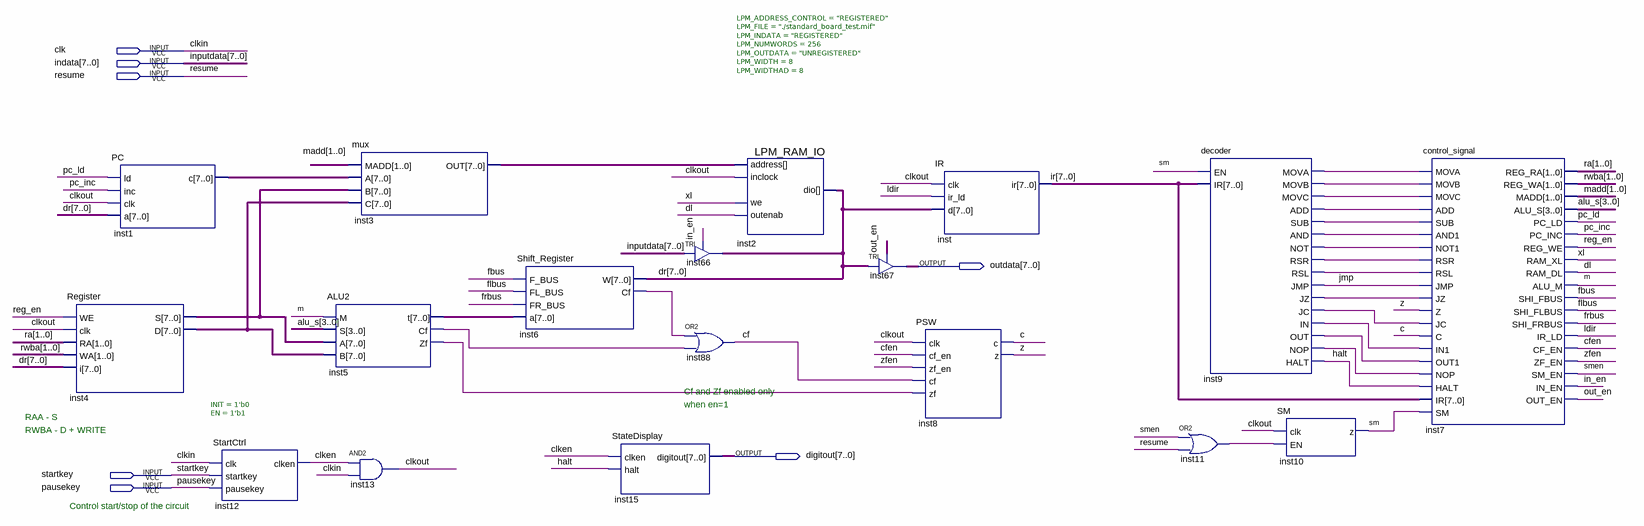
[diagram p0: schematic sheet]
// Quartus schematic model_computer.bdf as structural Verilog: 18 symbols, 7 pins
module model_computer (
  input  clk,
  input  [7:0] indata,
  input  resume,
  input  startkey,
  input  pausekey,
  output [7:0] outdata,
  output [7:0] digitout
);

  wire c, cf, cfen, clken, clkout, dl, fbus, flbus, frbus, halt, in_en, inst5_cf, inst5_zf, inst6_cf,
       inst9_add, inst9_and, inst9_in, inst9_jc, inst9_jz, inst9_mova, inst9_movb, inst9_movc, inst9_nop,
       inst9_not, inst9_out, inst9_rsl, inst9_rsr, inst9_sub, inst11_out, jmp, ldir, m, out_en, pc_inc,
       pc_ld, reg_en, sm, smen, xl, z, zfen;
  wire [1:0] madd, ra, rwba;
  wire [3:0] alu_s;
  wire [7:0] dr, inst1_c, inst3_out, inst4_d, inst4_s, inst5_t, ir;

  Register inst4 (.WE(reg_en), .clk(clkout), .RA(ra), .WA(rwba), .i(dr), .S(inst4_s), .D(inst4_d));
  PC inst1 (.ld(pc_ld), .inc(pc_inc), .clk(clkout), .a(dr), .c(inst1_c));
  StartCtrl #(.INIT(1'b0), .EN(1'b1)) inst12 (.clk(clk), .startkey(startkey), .pausekey(pausekey), .clken(clken));
  mux inst3 (.MADD(madd), .A(inst1_c), .B(inst4_s), .C(inst4_d), .OUT(inst3_out));
  ALU2 inst5 (.M(m), .S(alu_s), .A(inst4_s), .B(inst4_d), .t(inst5_t), .Cf(inst5_cf), .Zf(inst5_zf));
  and inst13 (clkout, clken, clk);
  Shift_Register inst6 (.F_BUS(fbus), .FL_BUS(flbus), .FR_BUS(frbus), .a(inst5_t), .W(dr), .Cf(inst6_cf));
  StateDisplay inst15 (.clken(clken), .halt(halt), .digitout(digitout));
  TRI inst66[7:0] (.IN(indata), .OE(in_en), .OUT(dr));
  or inst88 (cf, inst6_cf, inst5_cf);
  LPM_RAM_IO #(.LPM_ADDRESS_CONTROL("REGISTERED"), .LPM_FILE("./standard_board_test.mif"), .LPM_INDATA("REGISTERED"), .LPM_NUMWORDS(256), .LPM_OUTDATA("UNREGISTERED"), .LPM_WIDTH(8), .LPM_WIDTHAD(8)) inst2 (
    .address(inst3_out), .inclock(clkout), .outenab(dl), .we(xl), .dio(dr));
  TRI inst67[7:0] (.IN(dr), .OE(out_en), .OUT(outdata));
  PSW inst8 (.clk(clkout), .cf_en(cfen), .zf_en(zfen), .cf(cf), .zf(inst5_zf), .c(c), .z(z));
  IR inst (.clk(clkout), .ir_ld(ldir), .d(dr), .ir(ir));
  or inst11 (inst11_out, smen, resume);
  decoder inst9 (
    .EN(sm), .IR(ir), .MOVA(inst9_mova), .MOVB(inst9_movb), .MOVC(inst9_movc), .ADD(inst9_add),
    .SUB(inst9_sub), .AND(inst9_and), .NOT(inst9_not), .RSR(inst9_rsr), .RSL(inst9_rsl), .JMP(jmp),
    .JZ(inst9_jz), .JC(inst9_jc), .IN(inst9_in), .OUT(inst9_out), .NOP(inst9_nop), .HALT(halt));
  SM inst10 (.clk(clkout), .EN(inst11_out), .z(sm));
  control_signal inst7 (
    .MOVA(inst9_mova), .MOVB(inst9_movb), .MOVC(inst9_movc), .ADD(inst9_add), .SUB(inst9_sub),
    .AND1(inst9_and), .NOT1(inst9_not), .RSR(inst9_rsr), .RSL(inst9_rsl), .JMP(jmp), .JZ(inst9_jz), .Z(z),
    .JC(inst9_jc), .C(c), .IN1(inst9_in), .OUT1(inst9_out), .NOP(inst9_nop), .HALT(halt), .IR(ir), .SM(sm),
    .REG_RA(ra), .REG_WA(rwba), .MADD(madd), .ALU_S(alu_s), .PC_LD(pc_ld), .PC_INC(pc_inc), .REG_WE(reg_en),
    .RAM_XL(xl), .RAM_DL(dl), .ALU_M(m), .SHI_FBUS(fbus), .SHI_FLBUS(flbus), .SHI_FRBUS(frbus), .IR_LD(ldir),
    .CF_EN(cfen), .ZF_EN(zfen), .SM_EN(smen), .IN_EN(in_en), .OUT_EN(out_en));

  // Other names for the same wires on the sheet: clkin = clk; inputdata[7:0] = indata

  // Notes on the sheet:
  //   Cf and Zf enabled only
  //   when en=1
  //   RAA - S
  //   RWBA - D + WRITE
  //   Control start/stop of the circuit
endmodule
